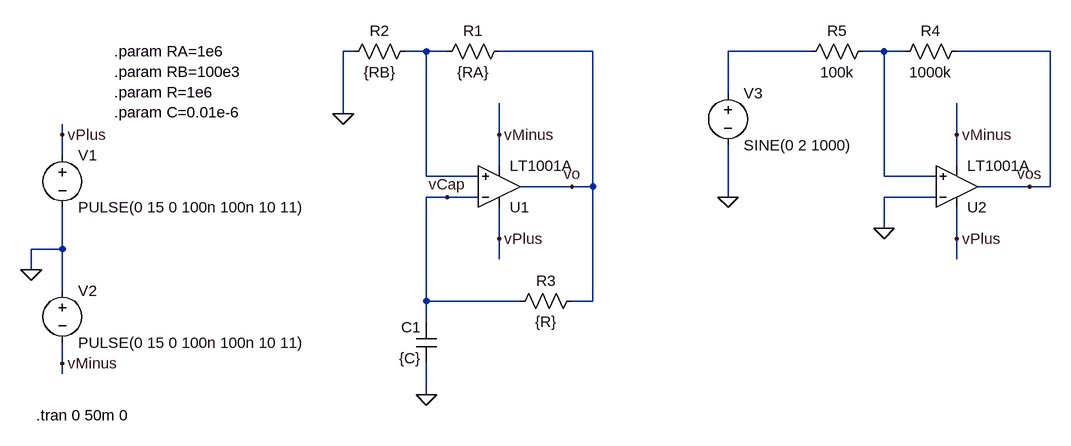
[diagram p0: schematic SquareWaveOscillator.asc]
SquareWaveOscillator.asc, the LTspice schematic file:
Version 4
SHEET 1 1204 680
WIRE 128 -128 112 -128
WIRE 240 -128 208 -128
WIRE 272 -128 240 -128
WIRE 496 -128 352 -128
WIRE 832 -128 704 -128
WIRE 944 -128 912 -128
WIRE 976 -128 944 -128
WIRE 1200 -128 1056 -128
WIRE 704 -64 704 -128
WIRE 112 -32 112 -128
WIRE -320 0 -320 -16
WIRE 352 0 352 -48
WIRE 1056 0 1056 -48
WIRE -320 32 -320 0
WIRE 352 48 352 0
WIRE 1056 48 1056 0
WIRE 240 64 240 -128
WIRE 320 64 240 64
WIRE 944 64 944 -128
WIRE 1024 64 944 64
WIRE 464 80 384 80
WIRE 496 80 496 -128
WIRE 496 80 464 80
WIRE 1168 80 1088 80
WIRE 1200 80 1200 -128
WIRE 1200 80 1168 80
WIRE 272 96 240 96
WIRE 320 96 272 96
WIRE 704 96 704 16
WIRE 1024 96 944 96
WIRE 944 144 944 96
WIRE 352 160 352 112
WIRE 1056 160 1056 112
WIRE -320 176 -320 112
WIRE -320 176 -368 176
WIRE 352 192 352 160
WIRE 1056 192 1056 160
WIRE -368 208 -368 176
WIRE -320 240 -320 176
WIRE 240 256 240 96
WIRE 384 256 240 256
WIRE 496 256 496 80
WIRE 496 256 464 256
WIRE 240 288 240 256
WIRE -320 352 -320 320
WIRE -320 368 -320 352
WIRE 240 400 240 352
FLAG -368 208 0
FLAG -320 0 vPlus
FLAG -320 352 vMinus
FLAG 352 160 vPlus
FLAG 352 0 vMinus
FLAG 464 80 vo
FLAG 240 400 0
FLAG 112 -32 0
FLAG 272 96 vCap
FLAG 1056 160 vPlus
FLAG 1056 0 vMinus
FLAG 1168 80 vos
FLAG 944 144 0
FLAG 704 96 0
SYMBOL Opamps\\LT1001A 352 144 M180
SYMATTR InstName U1
SYMBOL voltage -320 16 R0
WINDOW 123 0 0 Left 2
WINDOW 39 0 0 Left 2
SYMATTR InstName V1
SYMATTR Value PULSE(0 15 0 100n 100n 10 11)
SYMBOL voltage -320 224 R0
WINDOW 123 0 0 Left 2
WINDOW 39 0 0 Left 2
SYMATTR InstName V2
SYMATTR Value PULSE(0 15 0 100n 100n 10 11)
SYMBOL res 368 -144 R90
WINDOW 0 0 56 VBottom 2
WINDOW 3 32 56 VTop 2
SYMATTR InstName R1
SYMATTR Value {RA}
SYMBOL res 224 -144 R90
WINDOW 0 0 56 VBottom 2
WINDOW 3 32 56 VTop 2
SYMATTR InstName R2
SYMATTR Value {RB}
SYMBOL cap 256 352 R180
WINDOW 0 24 56 Left 2
WINDOW 3 24 8 Left 2
SYMATTR InstName C1
SYMATTR Value {C}
SYMBOL res 368 272 R270
WINDOW 0 32 56 VTop 2
WINDOW 3 0 56 VBottom 2
SYMATTR InstName R3
SYMATTR Value {R}
SYMBOL Opamps\\LT1001A 1056 144 M180
SYMATTR InstName U2
SYMBOL res 1072 -144 R90
WINDOW 0 0 56 VBottom 2
WINDOW 3 32 56 VTop 2
SYMATTR InstName R4
SYMATTR Value 1000k
SYMBOL res 928 -144 R90
WINDOW 0 0 56 VBottom 2
WINDOW 3 32 56 VTop 2
SYMATTR InstName R5
SYMATTR Value 100k
SYMBOL voltage 704 -80 R0
WINDOW 123 0 0 Left 0
WINDOW 39 0 0 Left 0
SYMATTR InstName V3
SYMATTR Value SINE(0 2 1000)
TEXT -360 432 Left 2 !.tran 0 50m 0
TEXT -240 -128 Left 2 !.param RA=1e6\n.param RB=100e3\n.param R=1e6\n.param C=0.01e-6

The netlist it stands for:
* SquareWaveOscillator.asc
XU1 N001 vCap vPlus vMinus vo LT1001  ; LT1001A, pins In+ In- V+ V- OUT
V1 vPlus 0 PULSE(0 15 0 100n 100n 10 11)
V2 0 vMinus PULSE(0 15 0 100n 100n 10 11)
R1 vo N001 {RA}
R2 N001 0 {RB}
C1 0 vCap {C}
R3 vCap vo {R}
XU2 N003 0 vPlus vMinus vos LT1001  ; LT1001A, pins In+ In- V+ V- OUT
R4 vos N003 1000k
R5 N003 N002 100k
V3 N002 0 SINE(0 2 1000)
.tran 0 50m 0
.param RA=1e6
.param RB=100e3
.param R=1e6
.param C=0.01e-6
.lib LTC.lib
.backanno
.end